# Altium schematic sheet M25Px0_Serial_Flash_Memory.SchDoc
size A; DocumentNumber: 1; SheetNumber: 1; SheetTotal: 1
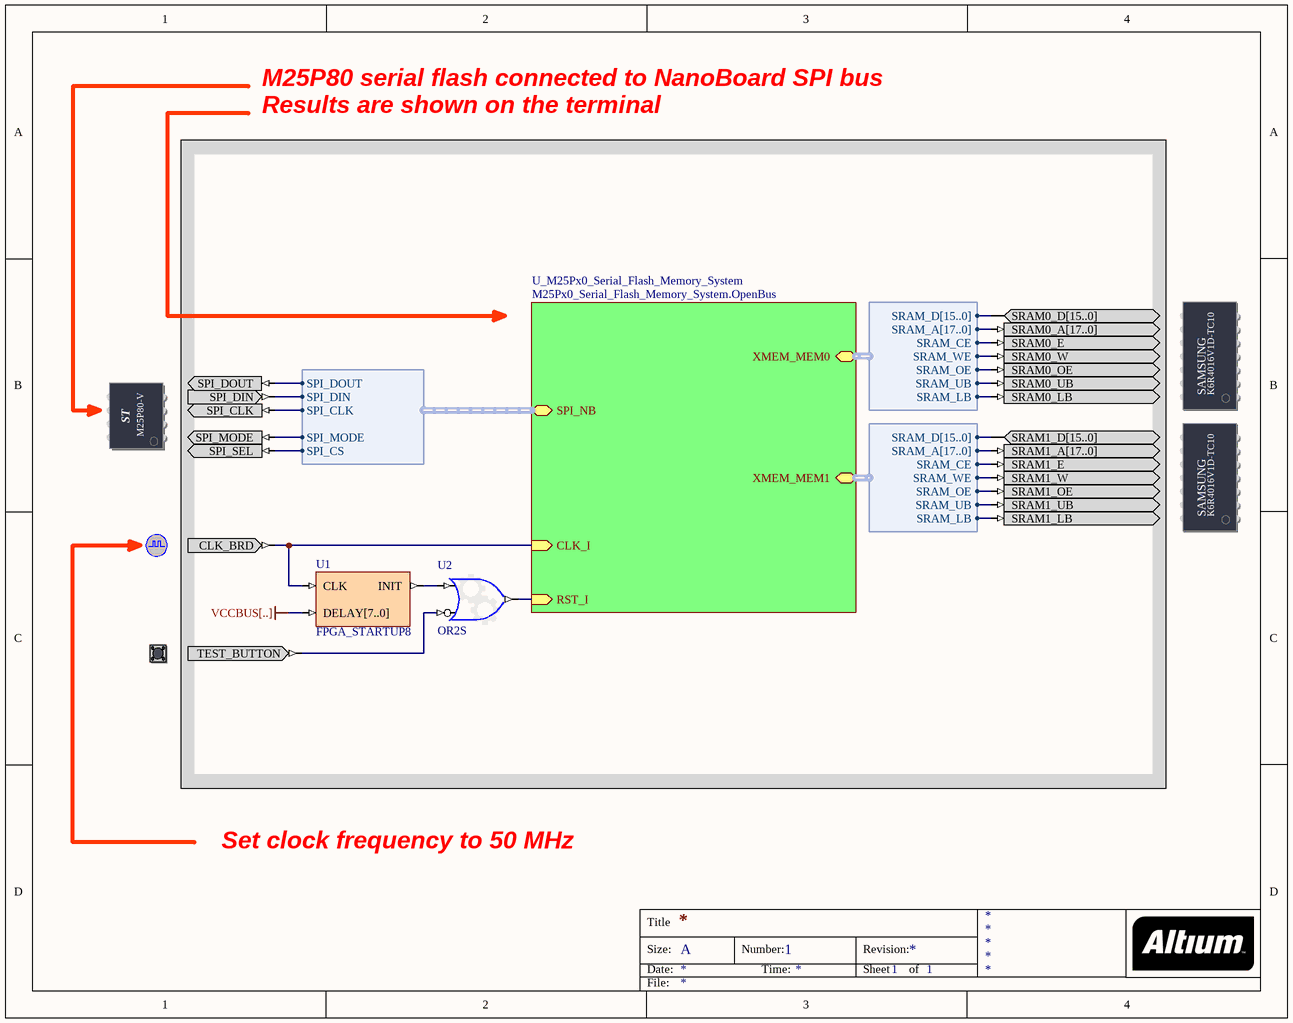
[diagram p0: M25Px0_Serial_Flash_Memory.SchDoc]

## Parts
(Parts that share a designator on the sheet are numbered #1, #2 ... from top to bottom, then left to right.)
?#1  SRAM_DAUGHTER0  (value not drawn)
?#2  SERIALFMEMORY  (value not drawn)
?#3  SRAM_DAUGHTER1  (value not drawn)
?#4  CLOCK_BOARD  (value not drawn)
?#5  TEST_BUTTON  (value not drawn)
U1  FPGA_STARTUP8
U2  OR2S

## Sub-sheets
U_M25Px0_Serial_Flash_Memory_System = M25Px0_Serial_Flash_Memory_System.OpenBus: RST_I (in), CLK_I (in), XMEM_MEM0 (harness WB_MEM_CTRL_SRAM16), XMEM_MEM1 (harness WB_MEM_CTRL_SRAM16), SPI_NB (harness SPI_W_NB)

## Harnesses
WB_MEM_CTRL_SRAM16: SRAM_D[15..0], SRAM_A[17..0], SRAM_CE, SRAM_WE, SRAM_OE, SRAM_UB, SRAM_LB
SPI_W_NB: SPI_DOUT, SPI_DIN, SPI_CLK, SPI_MODE, SPI_CS

## Nets
VCCBUS[..]: U1.DELAY[7..0]
Net?#1_SRAM0_A[17..0]: ?#1.SRAM0_A[17..0] ; sheet U_M25Px0_Serial_Flash_Memory_System/XMEM_MEM0.SRAM_A[17..0]
Net?#1_SRAM0_D[15..0]: ?#1.SRAM0_D[15..0] ; sheet U_M25Px0_Serial_Flash_Memory_System/XMEM_MEM0.SRAM_D[15..0]
Net?#1_SRAM0_E: ?#1.SRAM0_E ; sheet U_M25Px0_Serial_Flash_Memory_System/XMEM_MEM0.SRAM_CE
Net?#1_SRAM0_LB: ?#1.SRAM0_LB ; sheet U_M25Px0_Serial_Flash_Memory_System/XMEM_MEM0.SRAM_LB
Net?#1_SRAM0_OE: ?#1.SRAM0_OE ; sheet U_M25Px0_Serial_Flash_Memory_System/XMEM_MEM0.SRAM_OE
Net?#1_SRAM0_UB: ?#1.SRAM0_UB ; sheet U_M25Px0_Serial_Flash_Memory_System/XMEM_MEM0.SRAM_UB
Net?#1_SRAM0_W: ?#1.SRAM0_W ; sheet U_M25Px0_Serial_Flash_Memory_System/XMEM_MEM0.SRAM_WE
Net?#2_SPI_CLK: ?#2.SPI_CLK ; sheet U_M25Px0_Serial_Flash_Memory_System/SPI_NB.SPI_CLK
Net?#2_SPI_DIN: ?#2.SPI_DIN ; sheet U_M25Px0_Serial_Flash_Memory_System/SPI_NB.SPI_DIN
Net?#2_SPI_DOUT: ?#2.SPI_DOUT ; sheet U_M25Px0_Serial_Flash_Memory_System/SPI_NB.SPI_DOUT
Net?#2_SPI_MODE: ?#2.SPI_MODE ; sheet U_M25Px0_Serial_Flash_Memory_System/SPI_NB.SPI_MODE
Net?#2_SPI_SEL: ?#2.SPI_SEL ; sheet U_M25Px0_Serial_Flash_Memory_System/SPI_NB.SPI_CS
Net?#3_SRAM1_A[17..0]: ?#3.SRAM1_A[17..0] ; sheet U_M25Px0_Serial_Flash_Memory_System/XMEM_MEM1.SRAM_A[17..0]
Net?#3_SRAM1_D[15..0]: ?#3.SRAM1_D[15..0] ; sheet U_M25Px0_Serial_Flash_Memory_System/XMEM_MEM1.SRAM_D[15..0]
Net?#3_SRAM1_E: ?#3.SRAM1_E ; sheet U_M25Px0_Serial_Flash_Memory_System/XMEM_MEM1.SRAM_CE
Net?#3_SRAM1_LB: ?#3.SRAM1_LB ; sheet U_M25Px0_Serial_Flash_Memory_System/XMEM_MEM1.SRAM_LB
Net?#3_SRAM1_OE: ?#3.SRAM1_OE ; sheet U_M25Px0_Serial_Flash_Memory_System/XMEM_MEM1.SRAM_OE
Net?#3_SRAM1_UB: ?#3.SRAM1_UB ; sheet U_M25Px0_Serial_Flash_Memory_System/XMEM_MEM1.SRAM_UB
Net?#3_SRAM1_W: ?#3.SRAM1_W ; sheet U_M25Px0_Serial_Flash_Memory_System/XMEM_MEM1.SRAM_WE
Net?#4_CLK_BRD: ?#4.CLK_BRD U1.CLK ; sheet U_M25Px0_Serial_Flash_Memory_System/CLK_I
Net?#5_TEST_BUTTON: ?#5.TEST_BUTTON U2.I1
NetU1_INIT: U1.INIT U2.I0
NetU2_O: U2.O ; sheet U_M25Px0_Serial_Flash_Memory_System/RST_I

## Notes on the sheet
- M25P80 serial flash connected to NanoBoard SPI bus
- Results are shown on the terminal
- Set clock frequency to 50 MHz
- Title
- Size:
- Date:
- A
- Number:
- Time:
- Revision:
- Sheet
- of
- File:
- (in symbol SERIALFMEMORY) ST; M25P80-V
- (in symbol SRAM_DAUGHTER0) SAMSUNG; K6R4016V1D-TC10
- (in symbol SRAM_DAUGHTER1) SAMSUNG; K6R4016V1D-TC10

## Library data of the parts
?#1 = SRAM_DAUGHTER0: Free Static RAM - Daughterboard; PortComponent: True; Published: 14-May-2007; Publisher: Altium Limited; HelpURL: TR0149 Technical Reference for Altium's Xilinx Spartan-3 Daughter Board DB30.pdf#page=16
?#2 = SERIALFMEMORY: Serial SPI Flash RAM; PortComponent: True; Published: 19-Nov-2003; Publisher: Altium Limited; HelpURL: TR0143 Technical Reference Manual for Altium's Desktop NanoBoard NB2DSK01.pdf#page=42; UseInDSF: True
?#3 = SRAM_DAUGHTER1: Free Static RAM - Daughterboard; PortComponent: True; Published: 14-May-2007; Publisher: Altium Limited; HelpURL: TR0149 Technical Reference for Altium's Xilinx Spartan-3 Daughter Board DB30.pdf#page=16
?#4 = CLOCK_BOARD: Global System Clock Supply; PortComponent: True; Published: 19-Nov-2003; Publisher: Altium Limited; HelpURL: TR0143 Technical Reference Manual for Altium's Desktop NanoBoard NB2DSK01.pdf#page=41; UseInDSF: True
?#5 = TEST_BUTTON: Test / Reset Button; PortComponent: True; Published: 19-Nov-2003; Publisher: Altium Limited; HelpURL: TR0143 Technical Reference Manual for Altium's Desktop NanoBoard NB2DSK01.pdf#page=53
U1 = FPGA_STARTUP8: FPGA Startup With 8 Bit Delay; Published: 9-Dec-2004; Publisher: Altium Limited; HelpURL: CR0119 FPGA_STARTUPx Powerup Delay Unit.pdf; LastRevisionNo: 1.00.00; ComponentLink1Description: Core &Resource Usage; ComponentLink1URL: CR0139 FPGA Peripheral Resource Usage.pdf#page=11
U2 = GATE: Configurable Generic Gate; ConfiguratorName: GENERIC_GATE; ConfigurationParameters: {}Version[1.0]{}GateKind[OR]{}BusInput[False]{}GateInputType[Bit]{}GateOutputOption[Normal]{}BusWidth[8]{}RegisterOutputs[False]{}NegativeClockEdge[False]{}InputCount[2]{}InputInvert0[False]{}InputInvert1[True]{}; LastRevisionNo: 1.00.00; Published: 3-Sep-2008; Publisher: Altium Limited